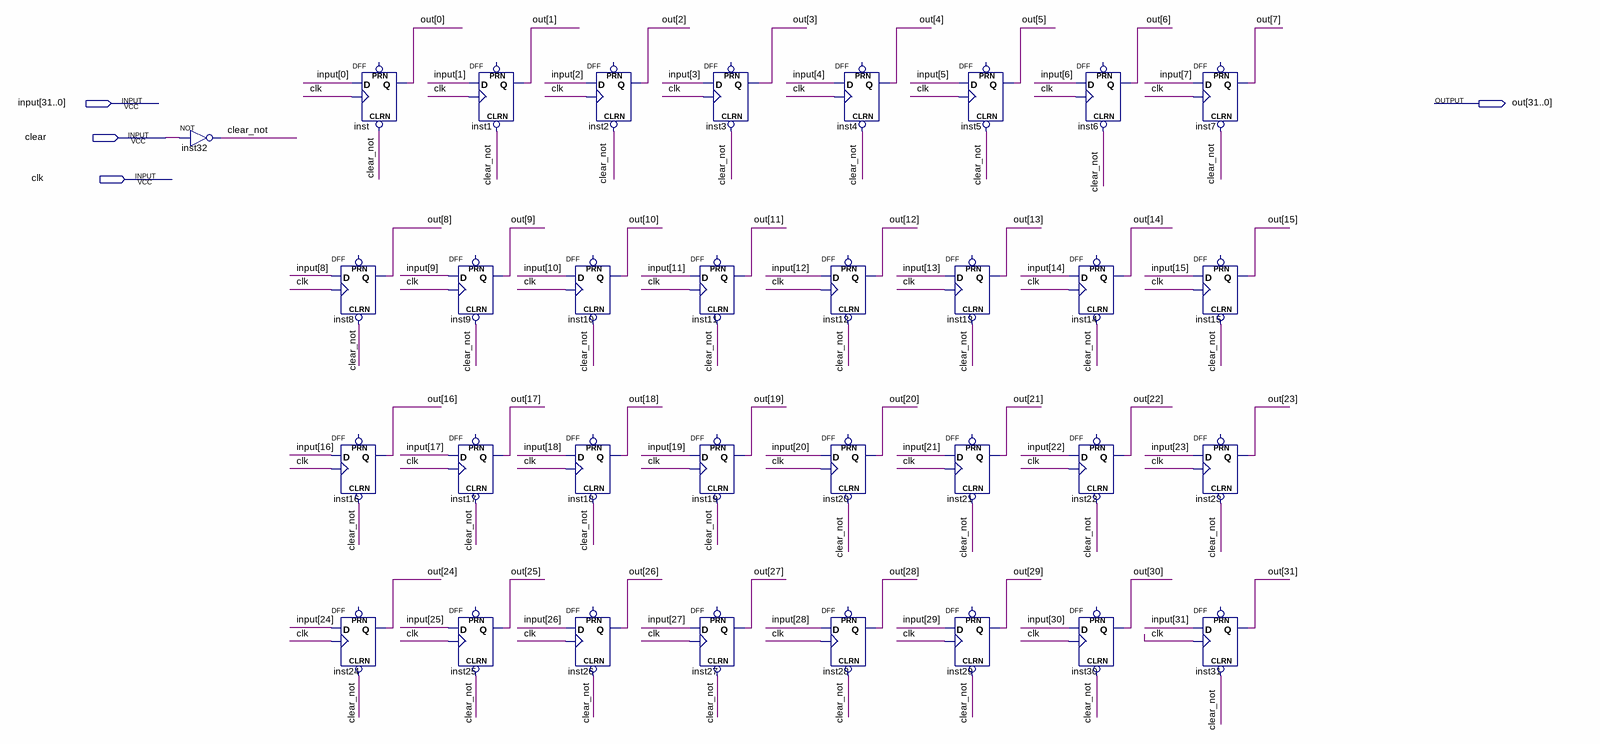
[diagram p0: schematic sheet]
// Quartus schematic 32_Bit_Register.bdf as structural Verilog: 33 symbols, 4 pins
module \32_Bit_Register  (
  input  [31:0] \input ,
  input  clear,
  input  clk,
  output [31:0] out
);

  wire clear_not;

  not inst32 (clear_not, clear);
  DFF inst (.CLRN(clear_not), .CLK(clk), .D(\input [0]), .Q(out[0]));  // open: PRN
  DFF inst8 (.CLRN(clear_not), .CLK(clk), .D(\input [8]), .Q(out[8]));  // open: PRN
  DFF inst16 (.CLRN(clear_not), .CLK(clk), .D(\input [16]), .Q(out[16]));  // open: PRN
  DFF inst24 (.CLRN(clear_not), .CLK(clk), .D(\input [24]), .Q(out[24]));  // open: PRN
  DFF inst1 (.CLRN(clear_not), .CLK(clk), .D(\input [1]), .Q(out[1]));  // open: PRN
  DFF inst9 (.CLRN(clear_not), .CLK(clk), .D(\input [9]), .Q(out[9]));  // open: PRN
  DFF inst17 (.CLRN(clear_not), .CLK(clk), .D(\input [17]), .Q(out[17]));  // open: PRN
  DFF inst25 (.CLRN(clear_not), .CLK(clk), .D(\input [25]), .Q(out[25]));  // open: PRN
  DFF inst2 (.CLRN(clear_not), .CLK(clk), .D(\input [2]), .Q(out[2]));  // open: PRN
  DFF inst10 (.CLRN(clear_not), .CLK(clk), .D(\input [10]), .Q(out[10]));  // open: PRN
  DFF inst18 (.CLRN(clear_not), .CLK(clk), .D(\input [18]), .Q(out[18]));  // open: PRN
  DFF inst26 (.CLRN(clear_not), .CLK(clk), .D(\input [26]), .Q(out[26]));  // open: PRN
  DFF inst11 (.CLRN(clear_not), .CLK(clk), .D(\input [11]), .Q(out[11]));  // open: PRN
  DFF inst19 (.CLRN(clear_not), .CLK(clk), .D(\input [19]), .Q(out[19]));  // open: PRN
  DFF inst27 (.CLRN(clear_not), .CLK(clk), .D(\input [27]), .Q(out[27]));  // open: PRN
  DFF inst3 (.CLRN(clear_not), .CLK(clk), .D(\input [3]), .Q(out[3]));  // open: PRN
  DFF inst4 (.CLRN(clear_not), .CLK(clk), .D(\input [4]), .Q(out[4]));  // open: PRN
  DFF inst12 (.CLRN(clear_not), .CLK(clk), .D(\input [12]), .Q(out[12]));  // open: PRN
  DFF inst20 (.CLRN(clear_not), .CLK(clk), .D(\input [20]), .Q(out[20]));  // open: PRN
  DFF inst28 (.CLRN(clear_not), .CLK(clk), .D(\input [28]), .Q(out[28]));  // open: PRN
  DFF inst5 (.CLRN(clear_not), .CLK(clk), .D(\input [5]), .Q(out[5]));  // open: PRN
  DFF inst13 (.CLRN(clear_not), .CLK(clk), .D(\input [13]), .Q(out[13]));  // open: PRN
  DFF inst21 (.CLRN(clear_not), .CLK(clk), .D(\input [21]), .Q(out[21]));  // open: PRN
  DFF inst29 (.CLRN(clear_not), .CLK(clk), .D(\input [29]), .Q(out[29]));  // open: PRN
  DFF inst6 (.CLRN(clear_not), .CLK(clk), .D(\input [6]), .Q(out[6]));  // open: PRN
  DFF inst14 (.CLRN(clear_not), .CLK(clk), .D(\input [14]), .Q(out[14]));  // open: PRN
  DFF inst22 (.CLRN(clear_not), .CLK(clk), .D(\input [22]), .Q(out[22]));  // open: PRN
  DFF inst30 (.CLRN(clear_not), .CLK(clk), .D(\input [30]), .Q(out[30]));  // open: PRN
  DFF inst7 (.CLRN(clear_not), .CLK(clk), .D(\input [7]), .Q(out[7]));  // open: PRN
  DFF inst15 (.CLRN(clear_not), .CLK(clk), .D(\input [15]), .Q(out[15]));  // open: PRN
  DFF inst23 (.CLRN(clear_not), .CLK(clk), .D(\input [23]), .Q(out[23]));  // open: PRN
  DFF inst31 (.CLRN(clear_not), .CLK(clk), .D(\input [31]), .Q(out[31]));  // open: PRN
endmodule
